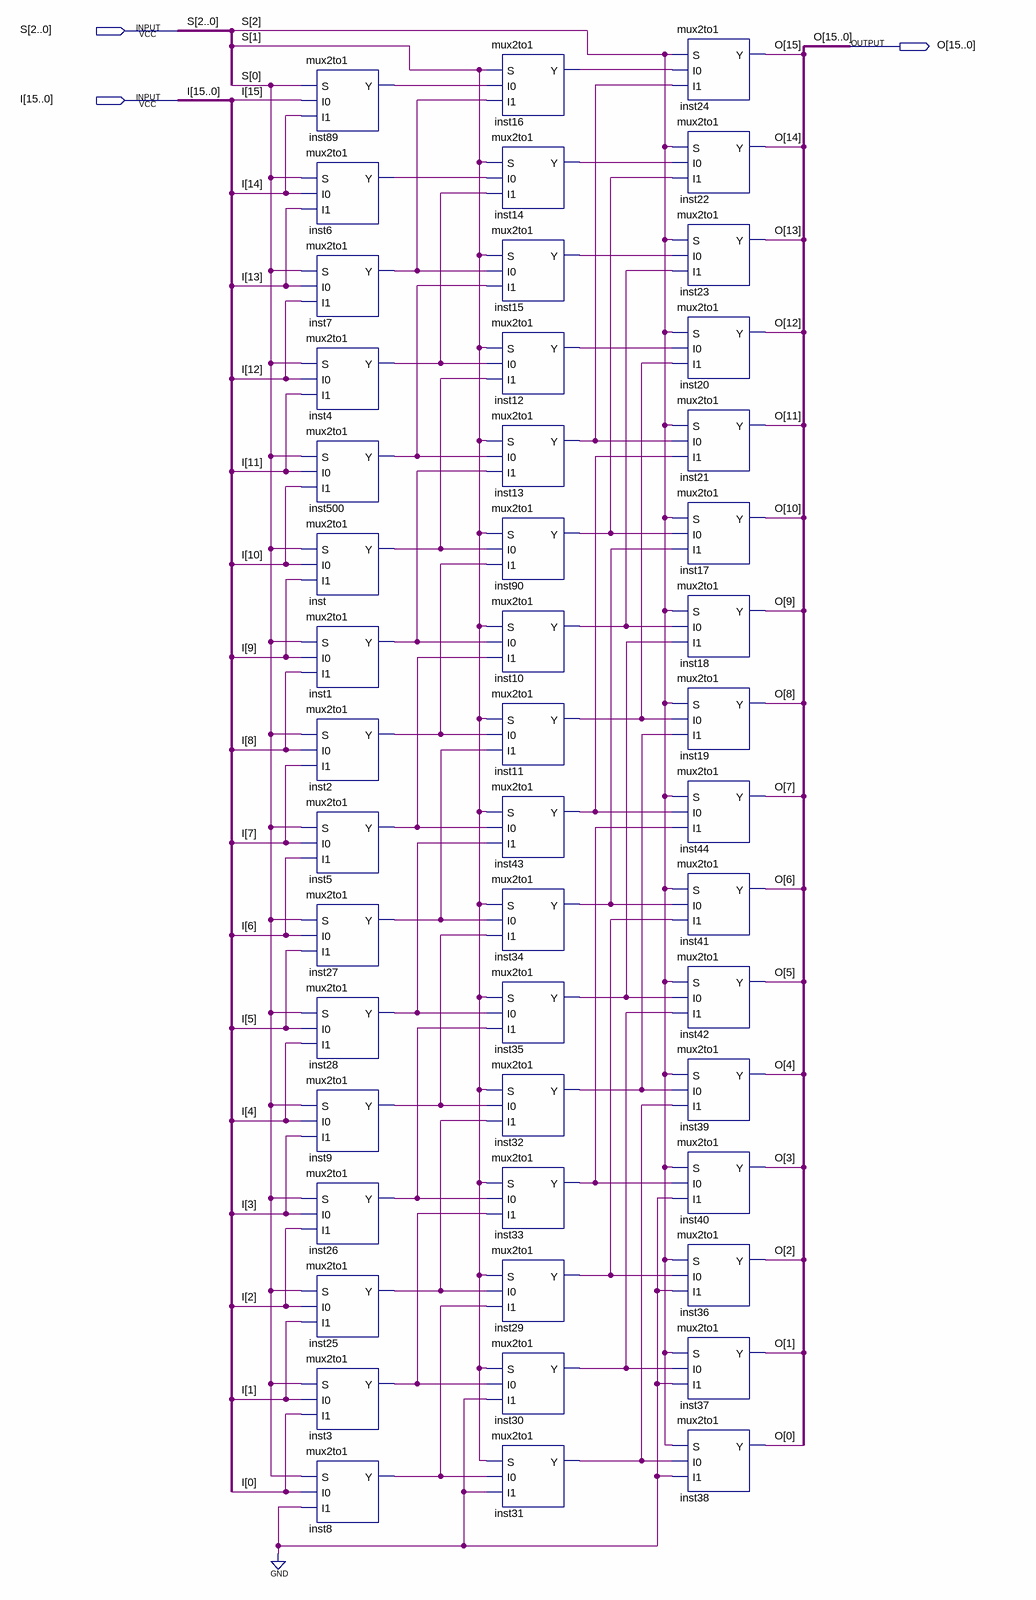
[diagram p0: schematic sheet]
// Quartus schematic BS3bit.bdf as structural Verilog: 48 symbols, 3 pins
module BS3bit (
  input  [2:0] S,
  input  [15:0] I,
  output [15:0] O
);

  wire inst1_y, inst2_y, inst3_y, inst4_y, inst5_y, inst6_y, inst7_y, inst8_y, inst9_y, inst10_y, inst11_y,
       inst12_y, inst13_y, inst14_y, inst15_y, inst16_y, inst25_y, inst26_y, inst27_y, inst28_y, inst29_y,
       inst30_y, inst31_y, inst32_y, inst33_y, inst34_y, inst35_y, inst43_y, inst89_y, inst90_y, inst500_y,
       inst_y;

  mux2to1 inst89 (.S(S[0]), .I0(I[15]), .I1(I[14]), .Y(inst89_y));
  mux2to1 inst6 (.S(S[0]), .I0(I[14]), .I1(I[13]), .Y(inst6_y));
  mux2to1 inst7 (.S(S[0]), .I0(I[13]), .I1(I[12]), .Y(inst7_y));
  mux2to1 inst4 (.S(S[0]), .I0(I[12]), .I1(I[11]), .Y(inst4_y));
  mux2to1 inst500 (.S(S[0]), .I0(I[11]), .I1(I[10]), .Y(inst500_y));
  mux2to1 inst (.S(S[0]), .I0(I[10]), .I1(I[9]), .Y(inst_y));
  mux2to1 inst1 (.S(S[0]), .I0(I[9]), .I1(I[8]), .Y(inst1_y));
  mux2to1 inst2 (.S(S[0]), .I0(I[8]), .I1(I[7]), .Y(inst2_y));
  mux2to1 inst5 (.S(S[0]), .I0(I[7]), .I1(I[6]), .Y(inst5_y));
  mux2to1 inst27 (.S(S[0]), .I0(I[6]), .I1(I[5]), .Y(inst27_y));
  mux2to1 inst28 (.S(S[0]), .I0(I[5]), .I1(I[4]), .Y(inst28_y));
  mux2to1 inst9 (.S(S[0]), .I0(I[4]), .I1(I[3]), .Y(inst9_y));
  mux2to1 inst26 (.S(S[0]), .I0(I[3]), .I1(I[2]), .Y(inst26_y));
  mux2to1 inst25 (.S(S[0]), .I0(I[2]), .I1(I[1]), .Y(inst25_y));
  mux2to1 inst3 (.S(S[0]), .I0(I[1]), .I1(I[0]), .Y(inst3_y));
  mux2to1 inst8 (.S(S[0]), .I0(I[0]), .I1(1'b0), .Y(inst8_y));
  mux2to1 inst16 (.S(S[1]), .I0(inst89_y), .I1(inst7_y), .Y(inst16_y));
  mux2to1 inst14 (.S(S[1]), .I0(inst6_y), .I1(inst4_y), .Y(inst14_y));
  mux2to1 inst15 (.S(S[1]), .I0(inst7_y), .I1(inst500_y), .Y(inst15_y));
  mux2to1 inst12 (.S(S[1]), .I0(inst4_y), .I1(inst_y), .Y(inst12_y));
  mux2to1 inst13 (.S(S[1]), .I0(inst500_y), .I1(inst1_y), .Y(inst13_y));
  mux2to1 inst90 (.S(S[1]), .I0(inst_y), .I1(inst2_y), .Y(inst90_y));
  mux2to1 inst10 (.S(S[1]), .I0(inst1_y), .I1(inst5_y), .Y(inst10_y));
  mux2to1 inst11 (.S(S[1]), .I0(inst2_y), .I1(inst27_y), .Y(inst11_y));
  mux2to1 inst43 (.S(S[1]), .I0(inst5_y), .I1(inst28_y), .Y(inst43_y));
  mux2to1 inst34 (.S(S[1]), .I0(inst27_y), .I1(inst9_y), .Y(inst34_y));
  mux2to1 inst35 (.S(S[1]), .I0(inst28_y), .I1(inst26_y), .Y(inst35_y));
  mux2to1 inst32 (.S(S[1]), .I0(inst9_y), .I1(inst25_y), .Y(inst32_y));
  mux2to1 inst33 (.S(S[1]), .I0(inst26_y), .I1(inst3_y), .Y(inst33_y));
  mux2to1 inst29 (.S(S[1]), .I0(inst25_y), .I1(inst8_y), .Y(inst29_y));
  mux2to1 inst30 (.S(S[1]), .I0(inst3_y), .I1(1'b0), .Y(inst30_y));
  mux2to1 inst31 (.S(S[1]), .I0(inst8_y), .I1(1'b0), .Y(inst31_y));
  mux2to1 inst24 (.S(S[2]), .I0(inst16_y), .I1(inst13_y), .Y(O[15]));
  mux2to1 inst22 (.S(S[2]), .I0(inst14_y), .I1(inst90_y), .Y(O[14]));
  mux2to1 inst23 (.S(S[2]), .I0(inst15_y), .I1(inst10_y), .Y(O[13]));
  mux2to1 inst20 (.S(S[2]), .I0(inst12_y), .I1(inst11_y), .Y(O[12]));
  mux2to1 inst21 (.S(S[2]), .I0(inst13_y), .I1(inst43_y), .Y(O[11]));
  mux2to1 inst17 (.S(S[2]), .I0(inst90_y), .I1(inst34_y), .Y(O[10]));
  mux2to1 inst18 (.S(S[2]), .I0(inst10_y), .I1(inst35_y), .Y(O[9]));
  mux2to1 inst19 (.S(S[2]), .I0(inst11_y), .I1(inst32_y), .Y(O[8]));
  mux2to1 inst44 (.S(S[2]), .I0(inst43_y), .I1(inst33_y), .Y(O[7]));
  mux2to1 inst41 (.S(S[2]), .I0(inst34_y), .I1(inst29_y), .Y(O[6]));
  mux2to1 inst42 (.S(S[2]), .I0(inst35_y), .I1(inst30_y), .Y(O[5]));
  mux2to1 inst39 (.S(S[2]), .I0(inst32_y), .I1(inst31_y), .Y(O[4]));
  mux2to1 inst40 (.S(S[2]), .I0(inst33_y), .I1(1'b0), .Y(O[3]));
  mux2to1 inst36 (.S(S[2]), .I0(inst29_y), .I1(1'b0), .Y(O[2]));
  mux2to1 inst37 (.S(S[2]), .I0(inst30_y), .I1(1'b0), .Y(O[1]));
  mux2to1 inst38 (.S(S[2]), .I0(inst31_y), .I1(1'b0), .Y(O[0]));
endmodule
